# Altium schematic sheet Breakout_schematic.SchDoc
size A4
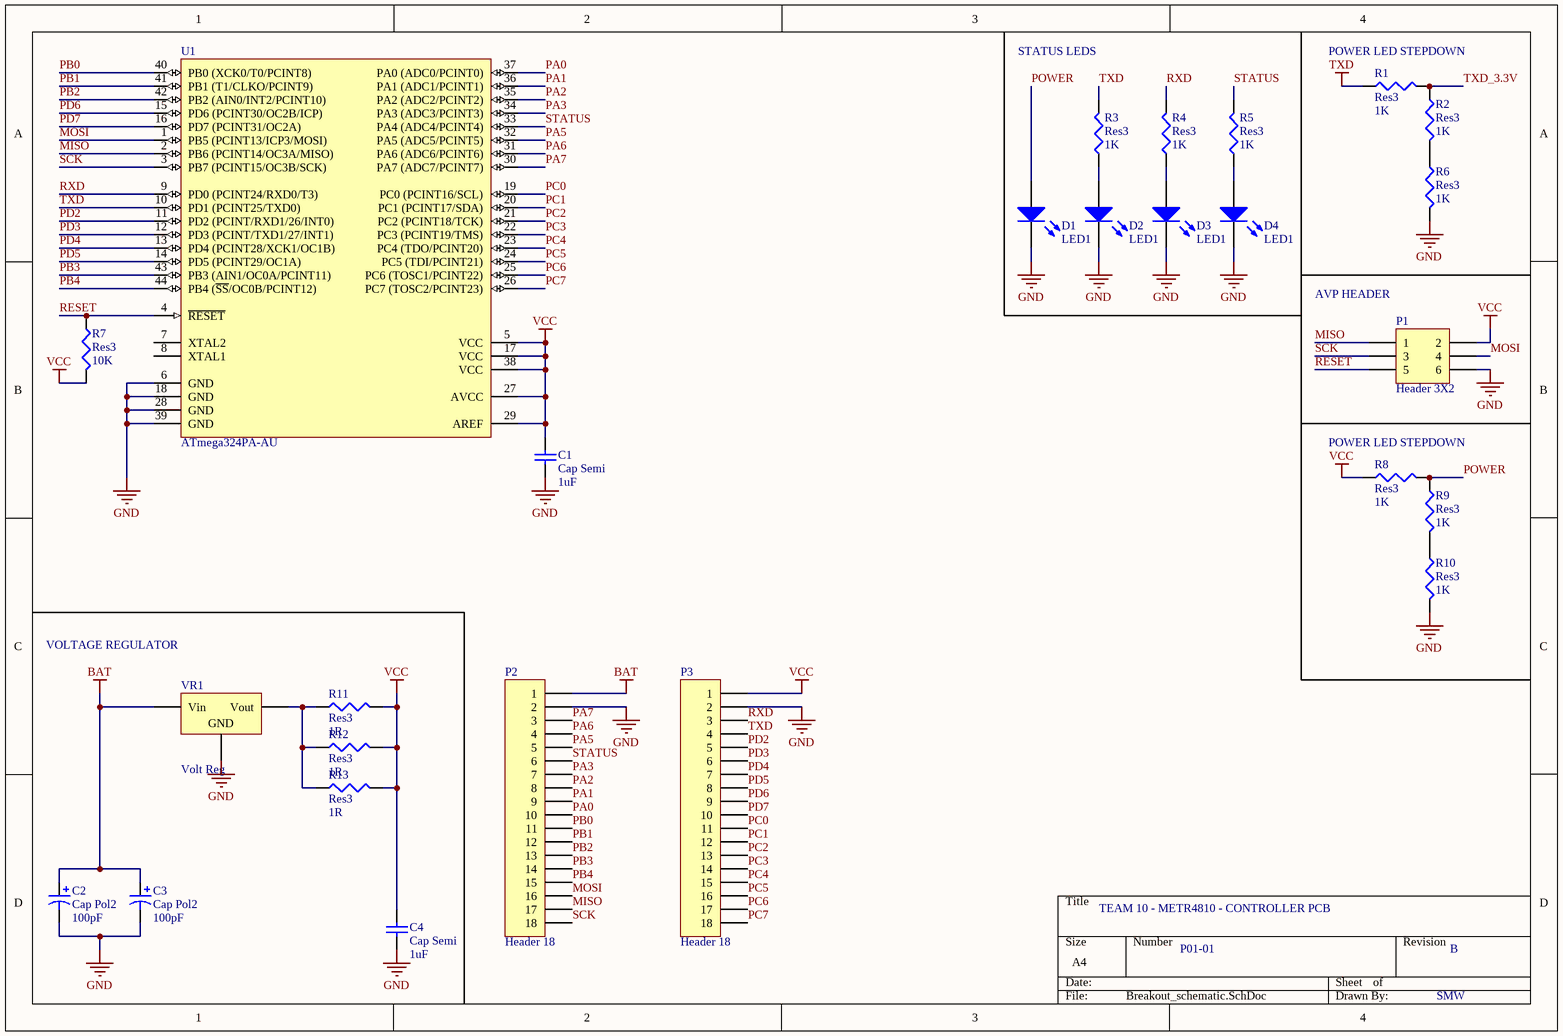
[diagram p0: Breakout_schematic.SchDoc]

## Parts
C1  Cap Semi  value 1uF  [C1206]
C2  Cap Pol2  value 100pF  [CAPAE9983X105M]
C3  Cap Pol2  value 100pF  [CAPAE9983X105M]
C4  Cap Semi  value 1uF  [C1206]
D1  LED1  [L0603]
D2  LED1  [L0603]
D3  LED1  [L0603]
D4  LED1  [L0603]
P1  Header 3X2  [HDR2X3]
P2  Header 18  [HDR1X18]
P3  Header 18  [HDR1X18]
R1  Res3  value 1K  [J1-0603]
R2  Res3  value 1K  [J1-0603]
R3  Res3  value 1K  [J1-0603]
R4  Res3  value 1K  [J1-0603]
R5  Res3  value 1K  [J1-0603]
R6  Res3  value 1K  [J1-0603]
R7  Res3  value 10K  [J1-0603]
R8  Res3  value 1K  [J1-0603]
R9  Res3  value 1K  [J1-0603]
R10  Res3  value 1K  [J1-0603]
R11  Res3  value 1R  [J1-0603]
R12  Res3  value 1R  [J1-0603]
R13  Res3  value 1R  [J1-0603]
U1  ATmega324PA-AU  [44A_N]
VR1  Volt Reg  [D2PAK_N]

## Nets
BAT: C2.1 C3.1 P2.1 VR1.1(Vin)
GND: C1.1 C2.2 C3.2 C4.1 D1.2(K) D2.2(K) D3.2(K) D4.2(K) P1.6 P2.2 P3.2 R6.2 R10.2 U1.6(GND) U1.18(GND) U1.28(GND) U1.39(GND) VR1.2(GND)
TXD: P3.4 R1.1 R3.2 U1.10(PD1_(PCINT25/TXD0))
VCC: C1.2 C4.2 P1.2 P3.1 R7.2 R8.1 R11.2 R12.2 R13.2 U1.5(VCC) U1.17(VCC) U1.27(AVCC) U1.29(AREF) U1.38(VCC)
MISO: P1.1 P2.17 U1.2(PB6_(PCINT14/OC3A/MISO))
MOSI: P1.4 P2.16 U1.1(PB5_(PCINT13/ICP3/MOSI))
PA0: P2.10 U1.37(PA0_(ADC0/PCINT0))
PA1: P2.9 U1.36(PA1_(ADC1/PCINT1))
PA2: P2.8 U1.35(PA2_(ADC2/PCINT2))
PA3: P2.7 U1.34(PA3_(ADC3/PCINT3))
PA5: P2.5 U1.32(PA5_(ADC5/PCINT5))
PA6: P2.4 U1.31(PA6_(ADC6/PCINT6))
PA7: P2.3 U1.30(PA7_(ADC7/PCINT7))
PB0: P2.11 U1.40(PB0_(XCK0/T0/PCINT8))
PB1: P2.12 U1.41(PB1_(T1/CLKO/PCINT9))
PB2: P2.13 U1.42(PB2_(AIN0/INT2/PCINT10))
PB3: P2.14 U1.43(PB3_(AIN1/OC0A/PCINT11))
PB4: P2.15 U1.44(PB4_(~{SS}/OC0B/PCINT12))
PC0: P3.11 U1.19(PC0_(PCINT16/SCL))
PC1: P3.12 U1.20(PC1_(PCINT17/SDA))
PC2: P3.13 U1.21(PC2_(PCINT18/TCK))
PC3: P3.14 U1.22(PC3_(PCINT19/TMS))
PC4: P3.15 U1.23(PC4_(TDO/PCINT20))
PC5: P3.16 U1.24(PC5_(TDI/PCINT21))
PC6: P3.17 U1.25(PC6_(TOSC1/PCINT22))
PC7: P3.18 U1.26(PC7_(TOSC2/PCINT23))
PD2: P3.5 U1.11(PD2_(PCINT/RXD1/26/INT0))
PD3: P3.6 U1.12(PD3_(PCINT/TXD1/27/INT1))
PD4: P3.7 U1.13(PD4_(PCINT28/XCK1/OC1B))
PD5: P3.8 U1.14(PD5_(PCINT29/OC1A))
PD6: P3.9 U1.15(PD6_(PCINT30/OC2B/ICP))
PD7: P3.10 U1.16(PD7_(PCINT31/OC2A))
POWER: D1.1(A) R8.2 R9.1
RESET: P1.5 R7.1 U1.4(~{RESET})
RXD: P3.3 R4.2 U1.9(PD0_(PCINT24/RXD0/T3))
SCK: P1.3 P2.18 U1.3(PB7_(PCINT15/OC3B/SCK))
STATUS: P2.6 R5.2 U1.33(PA4_(ADC4/PCINT4))
TXD_3.3V: R1.2 R2.1
NetD2_1: D2.1(A) R3.1
NetD3_1: D3.1(A) R4.1
NetD4_1: D4.1(A) R5.1
NetR2_2: R2.2 R6.1
NetR9_2: R9.2 R10.1
NetR11_1: R11.1 R12.1 R13.1 VR1.3(Vout)

Not connected (* = marked no-connect by the designer): U1 7(XTAL2) 8(XTAL1)

## Notes on the sheet
- STATUS LEDS
- POWER LED STEPDOWN
- (near P1) AVP HEADER
- VOLTAGE REGULATOR
- TEAM 10 - METR4810 - CONTROLLER PCB
- P01-01
- B
- SMW

## Library data of the parts
C1 C4 = Cap Semi: Capacitor (Semiconductor SIM Model); Published: 8-Jun-2000; LatestRevisionDate: 29-May-2009; LatestRevisionNote: IPC-7351 Footprint Added.; PackageReference: C1206; Publisher: Altium Limited; PackageDescription: Chip Capacitor
C2 C3 = Cap Pol2: Polarized Capacitor (Axial); Published: 8-Jun-2000; LatestRevisionDate: 17-Jul-2002; LatestRevisionNote: Re-released for DXP Platform.; PackageReference: POLAR0.8; Publisher: Altium Limited; PackageDescription: Polarized Capacitor; 2 Leads
D1-D4 = LED1: Typical RED GaAs LED; Published: 8-Jun-2000; LatestRevisionDate: 08-Jul-2005; LatestRevisionNote: Mech Layer 1 removed.; PackageReference: LED-1; Publisher: Altium Limited; PackageDescription: LED; 2 Leads
P1 = Header 3X2: Header, 3-Pin, Dual row; LatestRevisionDate: 17-Jul-2002; LatestRevisionNote: Re-released for DXP Platform.; Publisher: Altium Limited
P2 P3 = Header 18: Header, 18-Pin; LatestRevisionDate: 17-Jul-2002; LatestRevisionNote: Re-released for DXP Platform.; Publisher: Altium Limited
R1-R13 = Res3: Resistor; Published: 8-Jun-2000; LatestRevisionDate: 29-May-2009; LatestRevisionNote: IPC-7351 Footprint Added.; PackageReference: J1-0603; Publisher: Altium Limited; PackageDescription: Chip Resistor
U1 = ATmega324PA-AU: 8-bit AVR Microcontroller, 32KB Flash, 1KB EEPROM, 2KB SRAM, 44-pin TQFP, Industrial Grade (-40°C to 85°C); DatasheetVersion: revC, Jun-2011; PackageVersion: revC, Oct-2010; PackageReference: 44A; PackageDescription: 44-Pin Plastic Thin Profile Quad Flat Pack, 10 x 10 x 1.0 mm Body, 0.8 mm Pitch (TQFP); Code_JEDEC: MS-026-ACB; ComponentLink1Description: Manufacturer URL; ComponentLink1URL: http://www.atmel.com/; ComponentLink2Description: ATmega164A/164PA/324A/324PA/644A/644PA/1284/1284P Datasheet; ComponentLink2URL: http://www.atmel.com/dyn/resources/prod_documents/doc8272.pdf; ComponentLink3Description: ATmega164A/164PA/324A/324PA/644A/644PA/1284/1284P Summary; ComponentLink3URL: http://www.atmel.com/dyn/resources/prod_documents/8272S.pdf
VR1 = Volt Reg: Voltage Regulator; Published: 24-Mar-1999; LatestRevisionDate: 29-May-2009; LatestRevisionNote: IPC-7351 Footprint Added.; PackageReference: D2PAK; Publisher: Altium Limited; PackageDescription: 3-Pin Transistor Outline Package 2.54 mm Pitch, 15.1 mm Lead Span